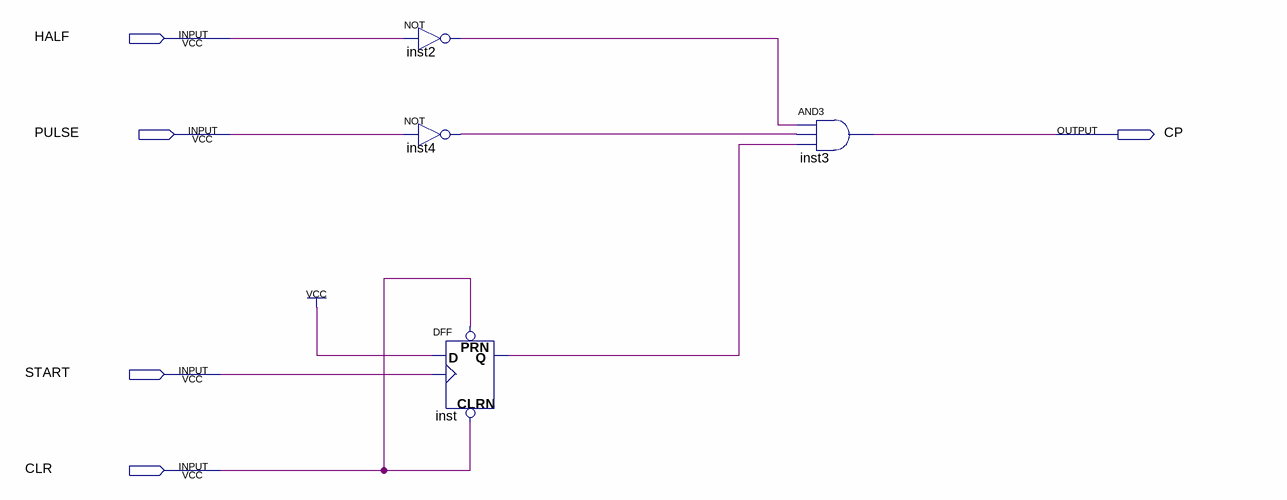
[diagram p0: schematic sheet]
// Quartus schematic start.bdf as structural Verilog: 4 symbols, 5 pins
module start (
  input  HALF,
  input  PULSE,
  input  START,
  input  CLR,
  output CP
);

  wire inst2_out, inst4_out, inst_q;

  not inst2 (inst2_out, HALF);
  not inst4 (inst4_out, PULSE);
  DFF inst (.CLRN(CLR), .CLK(START), .D(1'b1), .PRN(CLR), .Q(inst_q));
  and inst3 (CP, inst2_out, inst4_out, inst_q);
endmodule
